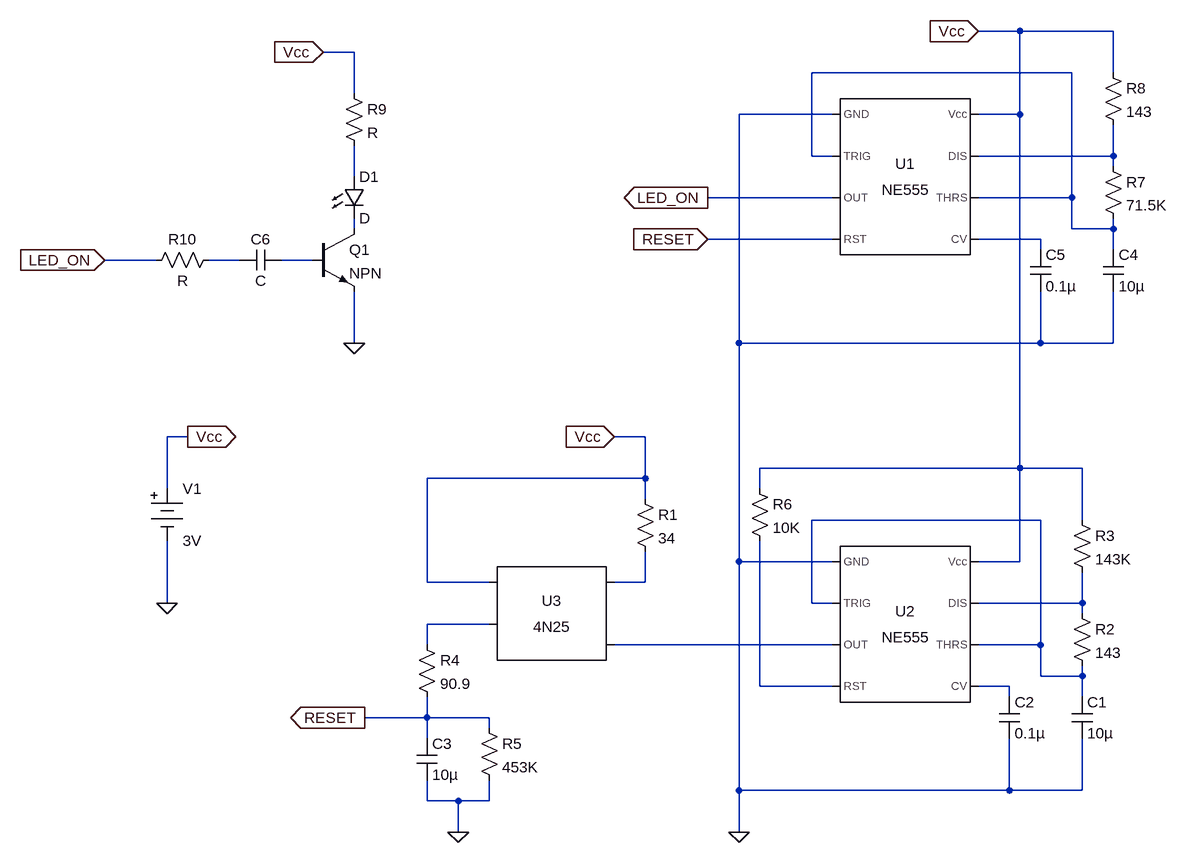
[diagram p0: schematic Pendant.asc]
Pendant.asc, the LTspice schematic file:
Version 4
SHEET 1 880 1028
WIRE 416 -256 352 -256
WIRE 560 -256 416 -256
WIRE -608 -224 -656 -224
WIRE 496 -192 96 -192
WIRE 560 -192 560 -256
WIRE -608 -160 -608 -224
WIRE 128 -128 -16 -128
WIRE 416 -128 416 -256
WIRE 416 -128 352 -128
WIRE 96 -64 96 -192
WIRE 128 -64 96 -64
WIRE 560 -64 560 -112
WIRE 560 -64 352 -64
WIRE 560 -48 560 -64
WIRE -608 -32 -608 -80
WIRE 128 0 -64 0
WIRE 496 0 496 -192
WIRE 496 0 352 0
WIRE -608 48 -608 32
WIRE 496 48 496 0
WIRE 560 48 560 32
WIRE 560 48 496 48
WIRE 128 64 -64 64
WIRE 448 64 352 64
WIRE 448 80 448 64
WIRE 560 80 560 48
WIRE -912 96 -992 96
WIRE -784 96 -832 96
WIRE -672 96 -720 96
WIRE -608 224 -608 144
WIRE -16 224 -16 -128
WIRE 448 224 448 144
WIRE 448 224 -16 224
WIRE 560 224 560 144
WIRE 560 224 448 224
WIRE -864 368 -896 368
WIRE -160 368 -208 368
WIRE 416 416 416 -128
WIRE 416 416 16 416
WIRE 512 416 416 416
WIRE -160 432 -160 368
WIRE -160 432 -496 432
WIRE -896 448 -896 368
WIRE 16 448 16 416
WIRE -160 464 -160 432
WIRE 448 496 96 496
WIRE 512 496 512 416
WIRE -16 560 -16 224
WIRE 128 560 -16 560
WIRE 416 560 416 416
WIRE 416 560 352 560
WIRE -496 592 -496 432
WIRE -400 592 -496 592
WIRE -160 592 -160 544
WIRE -160 592 -208 592
WIRE -896 624 -896 528
WIRE 96 624 96 496
WIRE 128 624 96 624
WIRE 512 624 512 576
WIRE 512 624 352 624
WIRE 512 640 512 624
WIRE -400 656 -496 656
WIRE -496 688 -496 656
WIRE 128 688 -208 688
WIRE 448 688 448 496
WIRE 448 688 352 688
WIRE 448 736 448 688
WIRE 512 736 512 720
WIRE 512 736 448 736
WIRE 16 752 16 528
WIRE 128 752 16 752
WIRE 400 752 352 752
WIRE 400 768 400 752
WIRE 512 768 512 736
WIRE -496 800 -496 768
WIRE -496 800 -592 800
WIRE -400 800 -496 800
WIRE -400 816 -400 800
WIRE -496 832 -496 800
WIRE -16 912 -16 560
WIRE 400 912 400 832
WIRE 400 912 -16 912
WIRE 512 912 512 832
WIRE 512 912 400 912
WIRE -496 928 -496 896
WIRE -448 928 -496 928
WIRE -400 928 -400 896
WIRE -400 928 -448 928
WIRE -448 976 -448 928
WIRE -16 976 -16 912
FLAG -16 976 0
FLAG -864 368 Vcc
IOPIN -864 368 Out
FLAG -896 624 0
FLAG 352 -256 Vcc
IOPIN 352 -256 In
FLAG -208 368 Vcc
IOPIN -208 368 In
FLAG -448 976 0
FLAG -592 800 RESET
IOPIN -592 800 Out
FLAG -64 64 RESET
IOPIN -64 64 In
FLAG -64 0 LED_ON
IOPIN -64 0 Out
FLAG -608 224 0
FLAG -656 -224 Vcc
IOPIN -656 -224 In
FLAG -992 96 LED_ON
IOPIN -992 96 In
SYMBOL Misc\\NE555 240 -32 R0
SYMATTR InstName U1
SYMBOL Misc\\NE555 240 656 R0
SYMATTR InstName U2
SYMBOL Optos\\4N25 -304 656 M0
SYMATTR InstName U3
SYMBOL Misc\\battery -896 432 R0
WINDOW 123 0 0 Left 0
WINDOW 39 0 0 Left 0
SYMATTR InstName V1
SYMATTR Value 3V
SYMBOL res -176 448 R0
SYMATTR InstName R1
SYMATTR Value 34
SYMATTR SpiceLine tol=1 pwr=0.1
SYMBOL res 496 624 R0
SYMATTR InstName R2
SYMATTR Value 143
SYMATTR SpiceLine tol=1 pwr=0.1
SYMBOL res 496 480 R0
SYMATTR InstName R3
SYMATTR Value 143K
SYMATTR SpiceLine tol=1 pwr=0.1
SYMBOL cap 496 768 R0
SYMATTR InstName C1
SYMATTR Value 10µ
SYMATTR SpiceLine V=10 Irms=0 Rser=0 Lser=0 mfg="Murata" pn="GRM188R61A106KE69" type="X5R"
SYMBOL cap 384 768 R0
SYMATTR InstName C2
SYMATTR Value 0.1µ
SYMATTR SpiceLine V=10 Irms=4.04 Rser=0.0357547 Lser=0 mfg="KEMET" pn="C0402C104K8RAC" type="X7R"
SYMBOL res -512 672 R0
SYMATTR InstName R4
SYMATTR Value 90.9
SYMATTR SpiceLine tol=1 pwr=0.1
SYMBOL cap -512 832 R0
SYMATTR InstName C3
SYMATTR Value 10µ
SYMATTR SpiceLine V=10 Irms=0 Rser=0 Lser=0 mfg="Murata" pn="GRM188R61A106KE69" type="X5R"
SYMBOL res -416 800 R0
SYMATTR InstName R5
SYMATTR Value 453K
SYMATTR SpiceLine tol=1 pwr=0.1
SYMBOL res 0 432 R0
SYMATTR InstName R6
SYMATTR Value 10K
SYMBOL res 544 -64 R0
SYMATTR InstName R7
SYMATTR Value 71.5K
SYMATTR SpiceLine tol=1 pwr=0.1
SYMBOL res 544 -208 R0
SYMATTR InstName R8
SYMATTR Value 143
SYMATTR SpiceLine tol=1 pwr=0.1
SYMBOL cap 544 80 R0
SYMATTR InstName C4
SYMATTR Value 10µ
SYMATTR SpiceLine V=10 Irms=0 Rser=0 Lser=0 mfg="Murata" pn="GRM188R61A106KE69" type="X5R"
SYMBOL cap 432 80 R0
SYMATTR InstName C5
SYMATTR Value 0.1µ
SYMATTR SpiceLine V=10 Irms=4.04 Rser=0.0357547 Lser=0 mfg="KEMET" pn="C0402C104K8RAC" type="X7R"
SYMBOL LED -624 -32 R0
SYMATTR InstName D1
SYMBOL res -624 -176 R0
SYMATTR InstName R9
SYMBOL res -816 80 R90
WINDOW 0 0 56 VBottom 2
WINDOW 3 32 56 VTop 2
SYMATTR InstName R10
SYMBOL cap -720 80 R90
WINDOW 0 0 32 VBottom 2
WINDOW 3 32 32 VTop 2
SYMATTR InstName C6
SYMBOL npn -672 48 R0
SYMATTR InstName Q1

The netlist it stands for:
* Pendant.asc
XU1 0 N001 LED_ON RESET N005 N001 N002 Vcc NE555  ; pins GND TRIG OUT RST CV THRS DIS Vcc
XU2 0 N008 N012 N013 N014 N008 N010 Vcc NE555  ; pins GND TRIG OUT RST CV THRS DIS Vcc
XU3 N009 N012 Vcc N011 NC_01 4N25
V1 Vcc 0 3V
R1 Vcc N009 34 tol=1 pwr=0.1
R2 N010 N008 143 tol=1 pwr=0.1
R3 Vcc N010 143K tol=1 pwr=0.1
C1 N008 0 10µ V=10 Irms=0 Rser=0 Lser=0 mfg="Murata" pn="GRM188R61A106KE69" type="X5R"
C2 N014 0 0.1µ V=10 Irms=4.04 Rser=0.0357547 Lser=0 mfg="KEMET" pn="C0402C104K8RAC" type="X7R"
R4 N011 RESET 90.9 tol=1 pwr=0.1
C3 RESET 0 10µ V=10 Irms=0 Rser=0 Lser=0 mfg="Murata" pn="GRM188R61A106KE69" type="X5R"
R5 RESET 0 453K tol=1 pwr=0.1
R6 Vcc N013 10K
R7 N002 N001 71.5K tol=1 pwr=0.1
R8 Vcc N002 143 tol=1 pwr=0.1
C4 N001 0 10µ V=10 Irms=0 Rser=0 Lser=0 mfg="Murata" pn="GRM188R61A106KE69" type="X5R"
C5 N005 0 0.1µ V=10 Irms=4.04 Rser=0.0357547 Lser=0 mfg="KEMET" pn="C0402C104K8RAC" type="X7R"
D1 N003 N004 D
R9 Vcc N003 R
R10 N006 LED_ON R
C6 N007 N006 C
Q1 N004 N007 0 0 NPN
.model D D
.lib standard.dio
.model NPN NPN
.model PNP PNP
.lib standard.bjt
.lib NE555.sub
.lib 4N25.sub
.backanno
.end